# Altium schematic sheet ST_LINK_V2.SCHDOC
size A4; DocumentNumber: 2; Revision: A.1(PCB.SCH); SheetNumber: 2; SheetTotal: 3
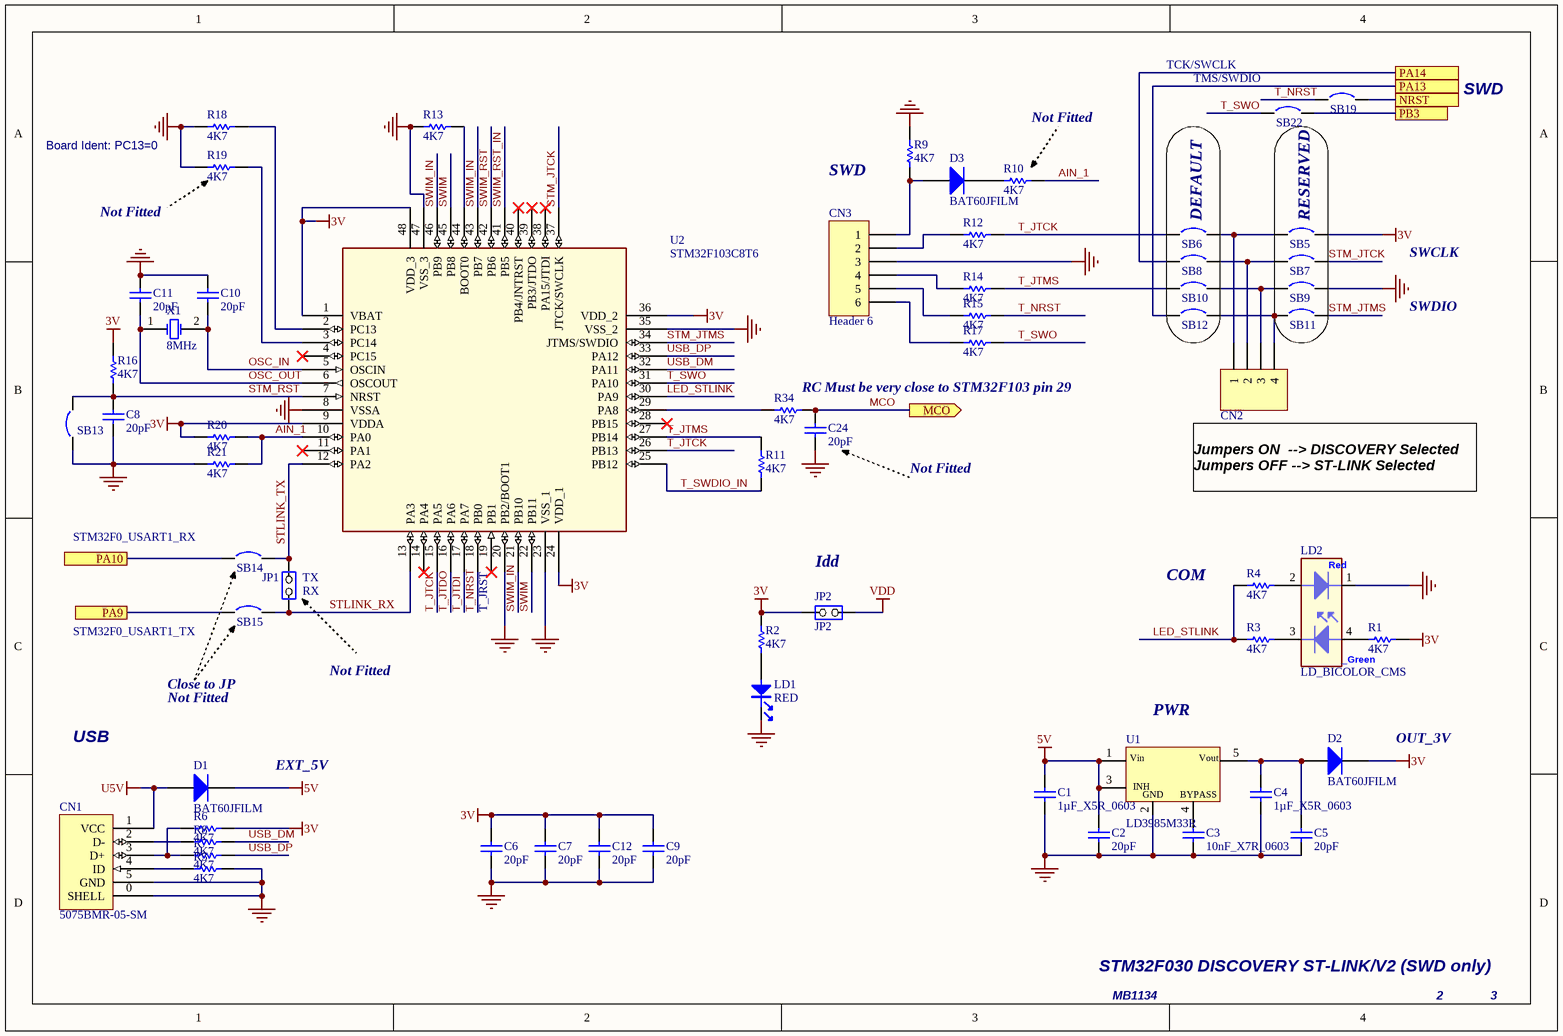
[diagram p0: ST_LINK_V2.SCHDOC]

## Parts
C1  1µF_X5R_0603  [CAPC1608X90]
C2  20pF  [CAPC1608X90]
C3  10nF_X7R_0603  [CAPC1608X90]
C4  1µF_X5R_0603  [CAPC1608X90]
C5  20pF  [CAPC1608X90]
C6  20pF  [CAPC1608X90]
C7  20pF  [CAPC1608X90]
C8  20pF  [CAPC1608X90]
C9  20pF  [CAPC1608X90]
C10  20pF  [CAPC1608X90]
C11  20pF  [CAPC1608X90]
C12  20pF  [CAPC1608X90]
C24  20pF  [CAPC1608X90]
CN1  5075BMR-05-SM  [AMPHENOL_10033526-N3212LF]
CN2  Header 4  [SAMTEC_TSW-104-23-F-S]  (value not drawn)
CN3  Header 6  [61300611121]
D1  BAT60JFILM  [SOD2613X115N]
D2  BAT60JFILM  [SOD2613X115N]
D3  BAT60JFILM  [SOD2613X115N]
JP1  (no value)  [SAMTEC_MTMM-101-10-G-D-135]
JP2  JP2  [SAMTEC_MTMM-101-10-G-D-135]
LD1  RED  [LED_SML-D12Y1WT86]
LD2  LD_BICOLOR_CMS  [LED_XZM2CRKM2DGFBB45SCCB]
R1  4K7  [RESC1005X35N]
R2  4K7  [RESC1005X35N]
R3  4K7  [RESC1005X35N]
R4  4K7  [RESC1005X35N]
R5  4K7  [RESC1005X35N]
R6  4K7  [RESC1005X35N]
R7  4K7  [RESC1005X35N]
R8  4K7  [RESC1005X35N]
R9  4K7  [RESC1005X35N]
R10  4K7  [RESC1005X35N]
R11  4K7  [RESC1005X35N]
R12  4K7  [RESC1005X35N]
R13  4K7  [RESC1005X35N]
R14  4K7  [RESC1005X35N]
R15  4K7  [RESC1005X35N]
R16  4K7  [RESC1005X35N]
R17  4K7  [RESC1005X35N]
R18  4K7  [RESC1005X35N]
R19  4K7  [RESC1005X35N]
R20  4K7  [RESC1005X35N]
R21  4K7  [RESC1005X35N]
R34  4K7  [RESC1005X35N]
SB5  Circuit Breaker  [RESC1005X35N]  (value not drawn)
SB6  Circuit Breaker  [RESC1005X35N]  (value not drawn)
SB7  Circuit Breaker  [RESC1005X35N]  (value not drawn)
SB8  Circuit Breaker  [RESC1005X35N]  (value not drawn)
SB9  Circuit Breaker  [RESC1005X35N]  (value not drawn)
SB10  Circuit Breaker  [RESC1005X35N]  (value not drawn)
SB11  Circuit Breaker  [RESC1005X35N]  (value not drawn)
SB12  Circuit Breaker  [RESC1005X35N]  (value not drawn)
SB13  Circuit Breaker  [RESC1005X35N]  (value not drawn)
SB14  Circuit Breaker  [RESC1005X35N]  (value not drawn)
SB15  Circuit Breaker  [RESC1005X35N]  (value not drawn)
SB19  Circuit Breaker  [RESC1005X35N]  (value not drawn)
SB22  Circuit Breaker  [RESC1005X35N]  (value not drawn)
U1  LD3985M33R  [SOT95P280X145-5N]
U2  STM32F103C8T6  [QFP50P900X900X160-48N]
X1  8MHz  [XTAL_ECS-080-20-5PX-TR]

## Blocks framed on the sheet
DEFAULT: SB6 SB8 SB10 SB12
RESERVED: SB5 SB7 SB9 SB11

## Ports
MCO (out), NRST, PA9, PA10, PA13, PA14, PB3

## Nets
3V: C6.2 C7.2 C9.2 C12.1 D2.2(K) JP2.1(COMMON) R1.2 R2.2 R6.2 R16.2 R20.1 SB5.2 U2.1(VBAT) U2.9(VDDA) U2.24(VDD_1) U2.36(VDD_2) U2.48(VDD_3)
5V: C1.2 C2.2 D1.2(K) U1.1(Vin) U1.3(CE)
GND: C1.1 C2.1 C3.1 C4.2 C5.1 C6.1 C7.1 C8.1 C9.1 C10.1 C11.1 C12.2 C24.2 CN1.0(SHELL) CN1.5(GND) CN3.3 LD1.2 LD2.1 R5.2 R9.2 R13.1 R18.1 R19.1 R21.1 SB9.2 SB13.1 U1.2(GND) U2.8(VSSA) U2.20(PB2/BOOT1) U2.23(VSS_1) U2.35(VSS_2) U2.47(VSS_3)
U5V: CN1.1(VCC) D1.1(A)
VDD: JP2.2(NO)
AIN_1: R10.2 R20.2 R21.2 U2.10(PA0)
LED_STLINK: R3.1 R4.1 U2.30(PA9)
MCO: C24.1 R34.2 ; port MCO
NRST: SB19.2 ; port NRST
OSC_IN: C10.2 U2.5(OSCIN) X1.2(OSC2)
OSC_OUT: C11.2 U2.6(OSCOUT) X1.1(OSC1)
PA9: SB15.1 ; port PA9
PA10: SB14.1 ; port PA10
PA13: SB12.1 ; port PA13
PA14: SB8.1 ; port PA14
PB3: SB22.2 ; port PB3
STLINK_RX: JP1.1(COMMON) SB15.2 U2.13(PA3)
STLINK_TX: JP1.2(NO) SB14.2 U2.12(PA2)
STM_JTCK: SB7.2 U2.37(JTCK/SWCLK)
STM_JTMS: SB11.2 U2.34(JTMS/SWDIO)
STM_RST: C8.2 R16.1 SB13.2 U2.7(NRST)
SWIM: U2.22(PB11) U2.45(PB8)
SWIM_IN: U2.21(PB10) U2.43(PB7) U2.46(PB9)
SWIM_RST: U2.42(PB6)
SWIM_RST_IN: U2.41(PB5)
T_JTCK: R12.2 SB6.1 U2.15(PA5) U2.26(PB13)
T_JTDI: U2.17(PA7)
T_JTDO: U2.16(PA6)
T_JTMS: R11.2 R14.2 SB10.1 U2.27(PB14)
T_NRST: R15.2 SB19.1 U2.18(PB0)
T_SWDIO_IN: R11.1 U2.25(PB12)
T_SWO: R17.2 SB22.1 U2.31(PA10)
USB_DM: R8.2 U2.32(PA11)
USB_DP: R7.2 U2.33(PA12)
NetC3_2: C3.2 U1.4(BYPASS)
NetC4_1: C4.1 C5.2 D2.1(A) U1.5(Vout)
NetCN1_2: CN1.2(D-) R8.1
NetCN1_3: CN1.3(D+) R6.1 R7.1
NetCN1_4: CN1.4(ID) R5.1
NetCN2_1: CN2.1 SB5.1 SB6.2
NetCN2_2: CN2.2 SB7.1 SB8.2
NetCN2_3: CN2.3 SB9.1 SB10.2
NetCN2_4: CN2.4 SB11.1 SB12.2
NetCN3_1: CN3.1 D3.1(A) R9.1
NetCN3_2: CN3.2 R12.1
NetCN3_4: CN3.4 R14.1
NetCN3_5: CN3.5 R15.1
NetCN3_6: CN3.6 R17.1
NetD3_2: D3.2(K) R10.1
NetLD1_1: LD1.1 R2.1
NetLD2_2: LD2.2 R4.2
NetLD2_3: LD2.3 R3.2
NetLD2_4: LD2.4 R1.1
NetR13_2: R13.2 U2.44(BOOT0)
NetR18_2: R18.2 U2.2(PC13)
NetR19_2: R19.2 U2.3(PC14)
NetR34_1: R34.1 U2.29(PA8)

Not connected (* = marked no-connect by the designer): U2 4(PC15)* 11(PA1)* 14(PA4)* 19(PB1)* 28(PB15)* 38(PA15/JTDI)* 39(PB3/JTDO)* 40(PB4/JNTRST)*

## Notes on the sheet
- TCK/SWCLK
- (near SB22) TMS/SWDIO
- SWD
- Board Ident: PC13=0
- Not Fitted
- SWCLK
- SWDIO
- (near R34) RC Must be very close to STM32F103 pin 29
- Jumpers ON  --> DISCOVERY Selected
  Jumpers OFF --> ST-LINK Selected
- STM32F0_USART1_RX
- (near JP1) TX
- (near JP2) Idd
- COM
- STM32F0_USART1_TX
- (near JP1) RX
- (near U2) T_JRST
- Close to JP
- (near U1) PWR
- USB
- EXT_5V
- OUT_3V
- STM32F030 DISCOVERY ST-LINK/V2 (SWD only)
- MB1134
- STMicroelectronics
- Title:
- Number:
- Rev:
- Date:
- Sheet       of
- (in symbol LD3985M33R) INH
- (in symbol LD_BICOLOR_CMS) Red; _Green

## Library data of the parts
C1 C4 = CAP SMD 0603  X5R 1µF 25V 10%: 0603  X5R 1µF; Rated voltage: 25V; Tolerance: 10%; Manufacturer: *; Manufacturer P/N: *; Order code Farnell: 1288202RL; Value: 1µF; Power: *; Technology: X5R; Temperature  Factor: *; Temperature Max: +125°C; Temperature Min: -55°C; STS Code: *
C2 C5-C12 C24 = Cap: Capacitor; Published: 8-Jun-2000; Revision: July-2002: Re-released for DXP Platform.; Publisher: Altium Limited; Value: 20pF
C3 = CAP SMD 0603  X7R 10000PF 50V 10%: 0603  X7R 10NF; Order code RS: 2040779; Rated voltage: 50V; Tolerance: 10%; Order code Farnell: 7569548RL; Value: 10NF; Power: *; Technology: X7R; Temperature Factor: *; Temperature Min: -55°C; Temperature Max: +125°C; STS Code: *
CN1 = USB-MINI-typeB connector
CN2 = Header 4: Header, 4-Pin; Revision: 17-Jul-2002: Re-released for DXP Platform.; Publisher: Altium Limited
CN3 = Header 6: Header, 6-Pin; LatestRevisionDate: 17-Jul-2002; LatestRevisionNote: Re-released for DXP Platform.; Publisher: Altium Limited
D1-D3 = BAT60JFILM: Manuf_1: STM; Code - JEDEC: DO-214-AB; Provided: ST; Published: 8-Jun-2000; Revision: July-2002: Re-released for DXP Platform.; Publisher: Altium Limited; Order: BAT60JFILM; Manuf_Part_1: BAT60JFILM; Distrib: ST
JP1 = JP2
LD1 = PHOTO
LD2 = LD_BICOLOR_CMS: Bicolor Led; Manuf_Part_1: HSMF-A201-A00J1; Manuf_1: Avago Technologies; Ref St: xxxxxx; cap_dec: ----; Distrib: RADIOSPARES; Footprint: HSMF-A201; support: ----
R1-R21 R34 = res1: Resistor; Published: 8-Jun-2000; Revision: July-2002: Re-released for DXP Platform.; Publisher: Altium Limited; Value: 4K7
SB5-SB15 SB19 SB22 = Circuit Breaker: Solder: NO; Published: 24-Mar-1999; Revision: July-2002: Re-released for DXP Platform.; Publisher: Altium Limited
U1 = LD3985M33R: Ultra low drop-low noise BiCMOS voltage, regulators low ESR capacitors compatible; Manuf_1: STM; Provided: ST; Ref St: 9176161; Manuf_Part_1: LD3985M33R; Distrib: ST; Order: LD3985M33R
U2 = STM32F103C8T6: Medium-density performance line ARM-based 32-bit MCU with 64KB Flash, USB, CAN, 7 timers, 2 ADCs; Manuf_1: STM; Ref St: 9175981; Provided: ST; Footprint: QFP48 7X7; Manuf_Part_1: STM32F103C8T6; Order: STM32F103C8T6; Distrib: ST
X1 = XTAL: Crystal Oscillator; Published: 8-Jun-2000; LatestRevisionDate: 17-Jul-2002; LatestRevisionNote: Re-released for DXP Platform.; PackageReference: R38; Publisher: Altium Limited